# EAGLE design pl8-dip-production (EAGLE 5.06)
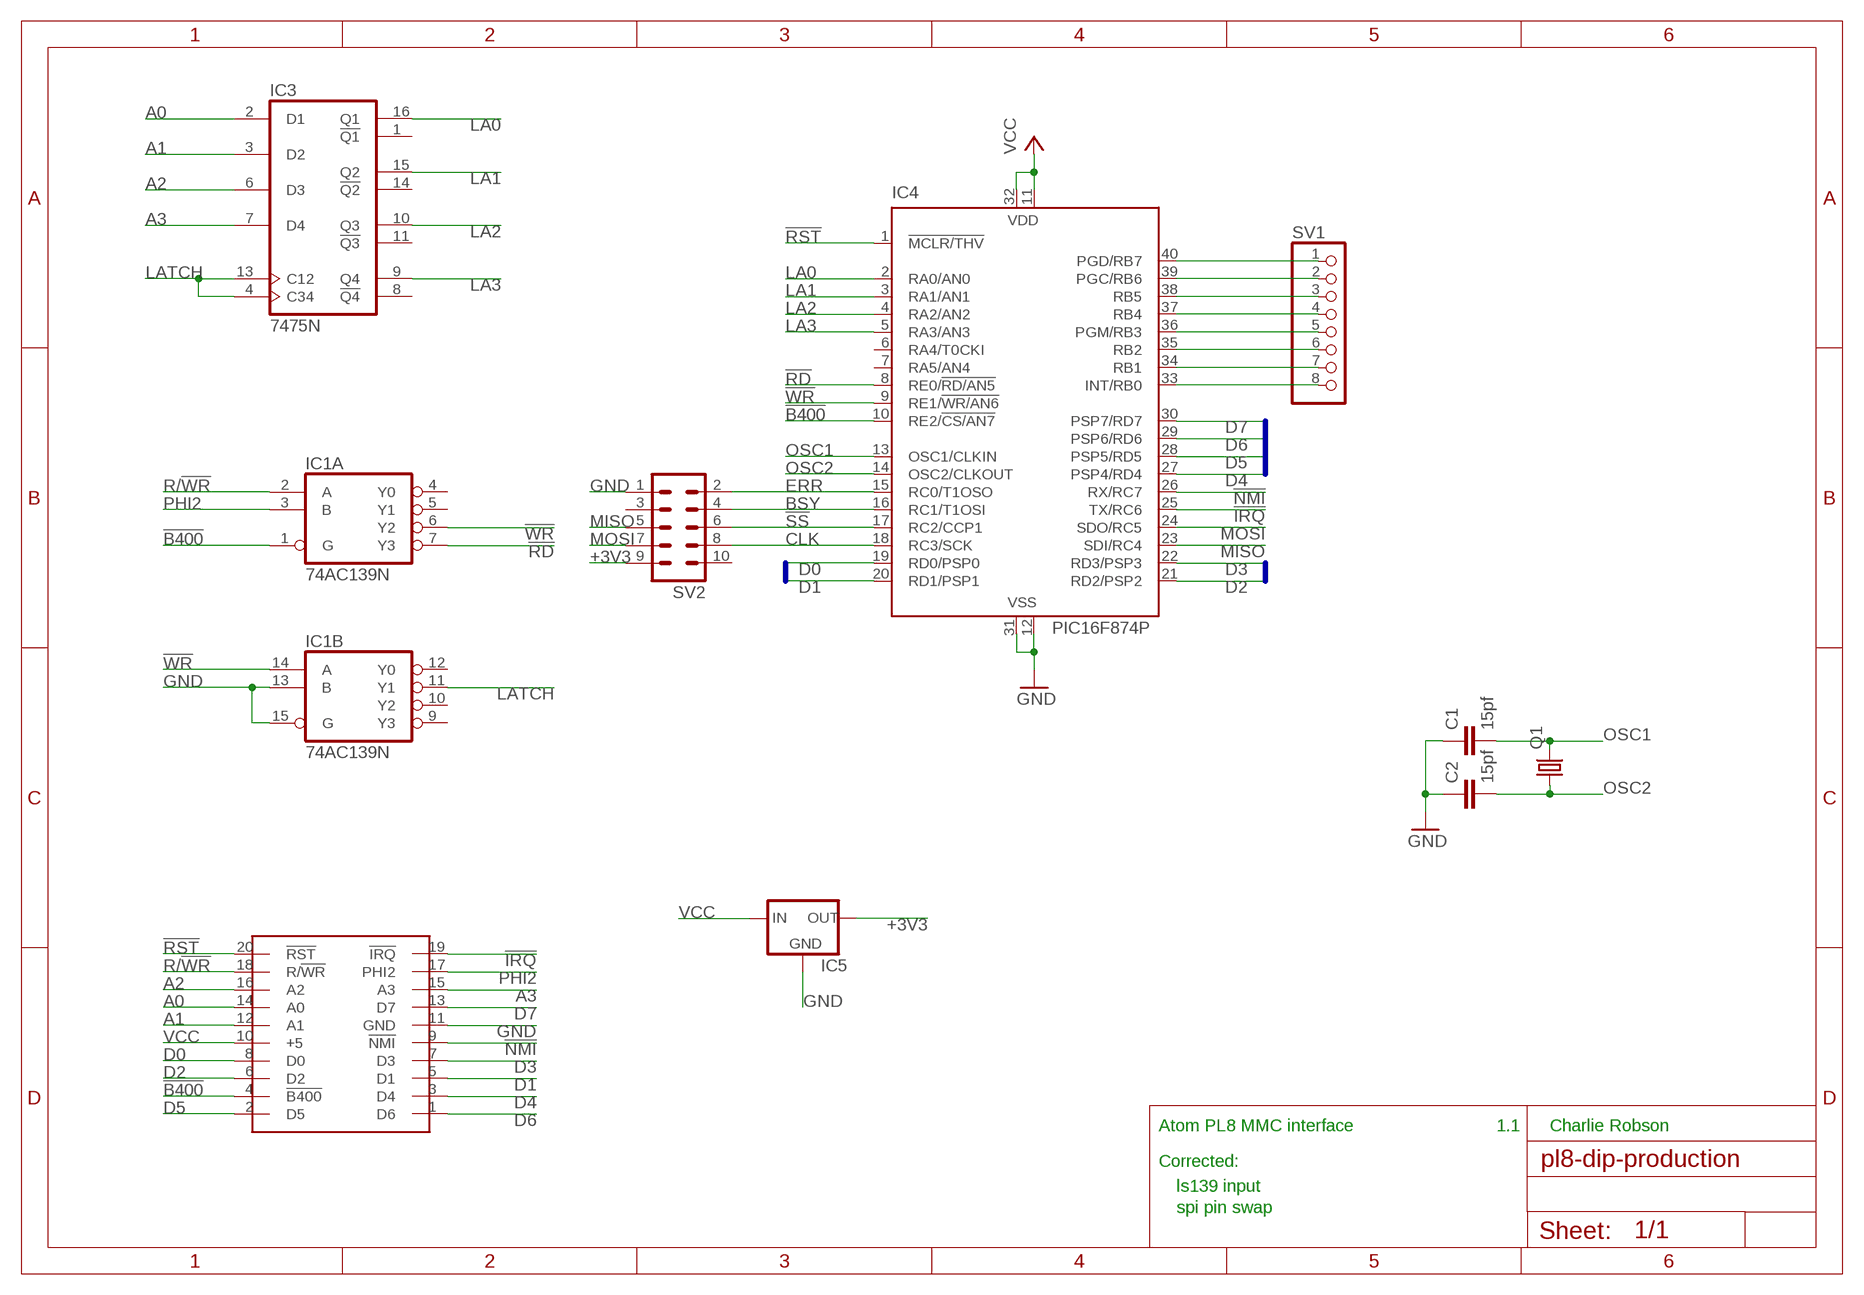
[diagram p0: schematic, sheet 1]

## Parts
C1  15pf  C-EUC1206  [C1206]
C2  15pf  C-EUC1206  [C1206]
IC1  74AC139N  [DIL16]
IC3  7475N  [DIL16]
IC4  PIC16F874P  [DIL40]
IC5  78LXX  [78LXX]
Q1  CRYSTALHC49S  [HC49/S]
SV1  PINHD-1X8  [1X08]
SV2  ML10  [ML10]
U$1  PL8-HEADER-MALE  [HEADER-M]

## Nets
!B400: IC1.1(A:G) IC4.10(RE2/!CS/AN7) U$1.4(!B400)
!IRQ: IC4.25(TX/RC6) U$1.19(!IRQ)
!NMI: IC4.26(RX/RC7) U$1.9(!NMI)
!RD: IC1.7(A:Y3) IC4.8(RE0/!RD/AN5)
!RST: IC4.1(!MCLR/THV) U$1.20(!RST)
!SS: IC4.17(RC2/CCP1) SV2.6
!WR: IC1.6(A:Y2) IC1.14(B:A) IC4.9(RE1/!WR/AN6)
+3V3: IC5.OUT SV2.9
A0: IC3.2(D1) U$1.14(A0)
A1: IC3.3(D2) U$1.12(A1)
A2: IC3.6(D3) U$1.16(A2)
A3: IC3.7(D4) U$1.15(A3)
BSY: IC4.16(RC1/T1OSI) SV2.4
CLK: IC4.18(RC3/SCK) SV2.8
D0: IC4.19(RD0/PSP0) U$1.8(D0)
D1: IC4.20(RD1/PSP1) U$1.5(D1)
D2: IC4.21(RD2/PSP2) U$1.6(D2)
D3: IC4.22(RD3/PSP3) U$1.7(D3)
D4: IC4.27(PSP4/RD4) U$1.3(D4)
D5: IC4.28(PSP5/RD5) U$1.2(D5)
D6: IC4.29(PSP6/RD6) U$1.1(D6)
D7: IC4.30(PSP7/RD7) U$1.13(D7)
ERR: IC4.15(RC0/T1OSO) SV2.2
GND: C1.1 C2.1 IC1.13(B:B) IC1.15(B:G) IC4.12(VSS) IC4.31(VSS) IC5.GND SV2.1 U$1.11(GND)
LA0: IC3.16(Q1) IC4.2(RA0/AN0)
LA1: IC3.15(Q2) IC4.3(RA1/AN1)
LA2: IC3.10(Q3) IC4.4(RA2/AN2)
LA3: IC3.9(Q4) IC4.5(RA3/AN3)
LATCH: IC1.11(B:Y1) IC3.4(C34) IC3.13(C12)
MISO: IC4.23(SDI/RC4) SV2.5
MOSI: IC4.24(SDO/RC5) SV2.7
N$1: IC4.40(PGD/RB7) SV1.1
N$2: IC4.39(PGC/RB6) SV1.2
N$3: IC4.38(RB5) SV1.3
N$4: IC4.37(RB4) SV1.4
N$5: IC4.36(PGM/RB3) SV1.5
N$6: IC4.35(RB2) SV1.6
N$7: IC4.34(RB1) SV1.7
N$8: IC4.33(INT/RB0) SV1.8
OSC1: C1.2 IC4.13(OSC1/CLKIN) Q1.2
OSC2: C2.2 IC4.14(OSC2/CLKOUT) Q1.1
PHI2: IC1.3(A:B) U$1.17(PHI2)
R/!WR: IC1.2(A:A) U$1.18(R/!WR)
VCC: IC4.11(VDD) IC4.32(VDD) IC5.IN U$1.10(+5)
Unconnected: IC1.4(A:Y0) IC1.5(A:Y1) IC1.9(B:Y3) IC1.10(B:Y2) IC1.12(B:Y0) IC3.1(!Q1) IC3.8(!Q4) IC3.11(!Q3) IC3.14(!Q2) IC4.6(RA4/T0CKI) IC4.7(RA5/AN4) SV2.3 SV2.10

## Buses
D[0..7]

## Notes on the sheet
- Atom PL8 MMC interface | 1.1 | Charlie Robson
- Corrected:
- ls139 input
- spi pin swap

## Power pins joined to a net without a drawn wire
GND: IC1.8(P:GND) IC3.12(GND)
VCC: IC1.16(P:VCC) IC3.5(VCC)

## Library data of the parts
C1 C2 = rcl:C-EU: CAPACITOR, European symbol
IC1 = 74xx-eu:74*139: Dual 2-line to 4-line DECODER/DEMULTIPLEXER
IC3 = 74xx-eu:74*75: 4-bit bistable LATCH
IC4 = microchip:PIC16F87*: MICROCONTROLLER
IC5 = v-reg:78LXX: VOLTAGE REGULATOR
Q1 = crystal:CRYSTAL: CRYSTAL
SV1 = pinhead:PINHD-1X8: PIN HEADER
SV2 = con-harting-ml:ML10: HARTING
U$1 = atom:PL8-HEADER-MALE

## Board
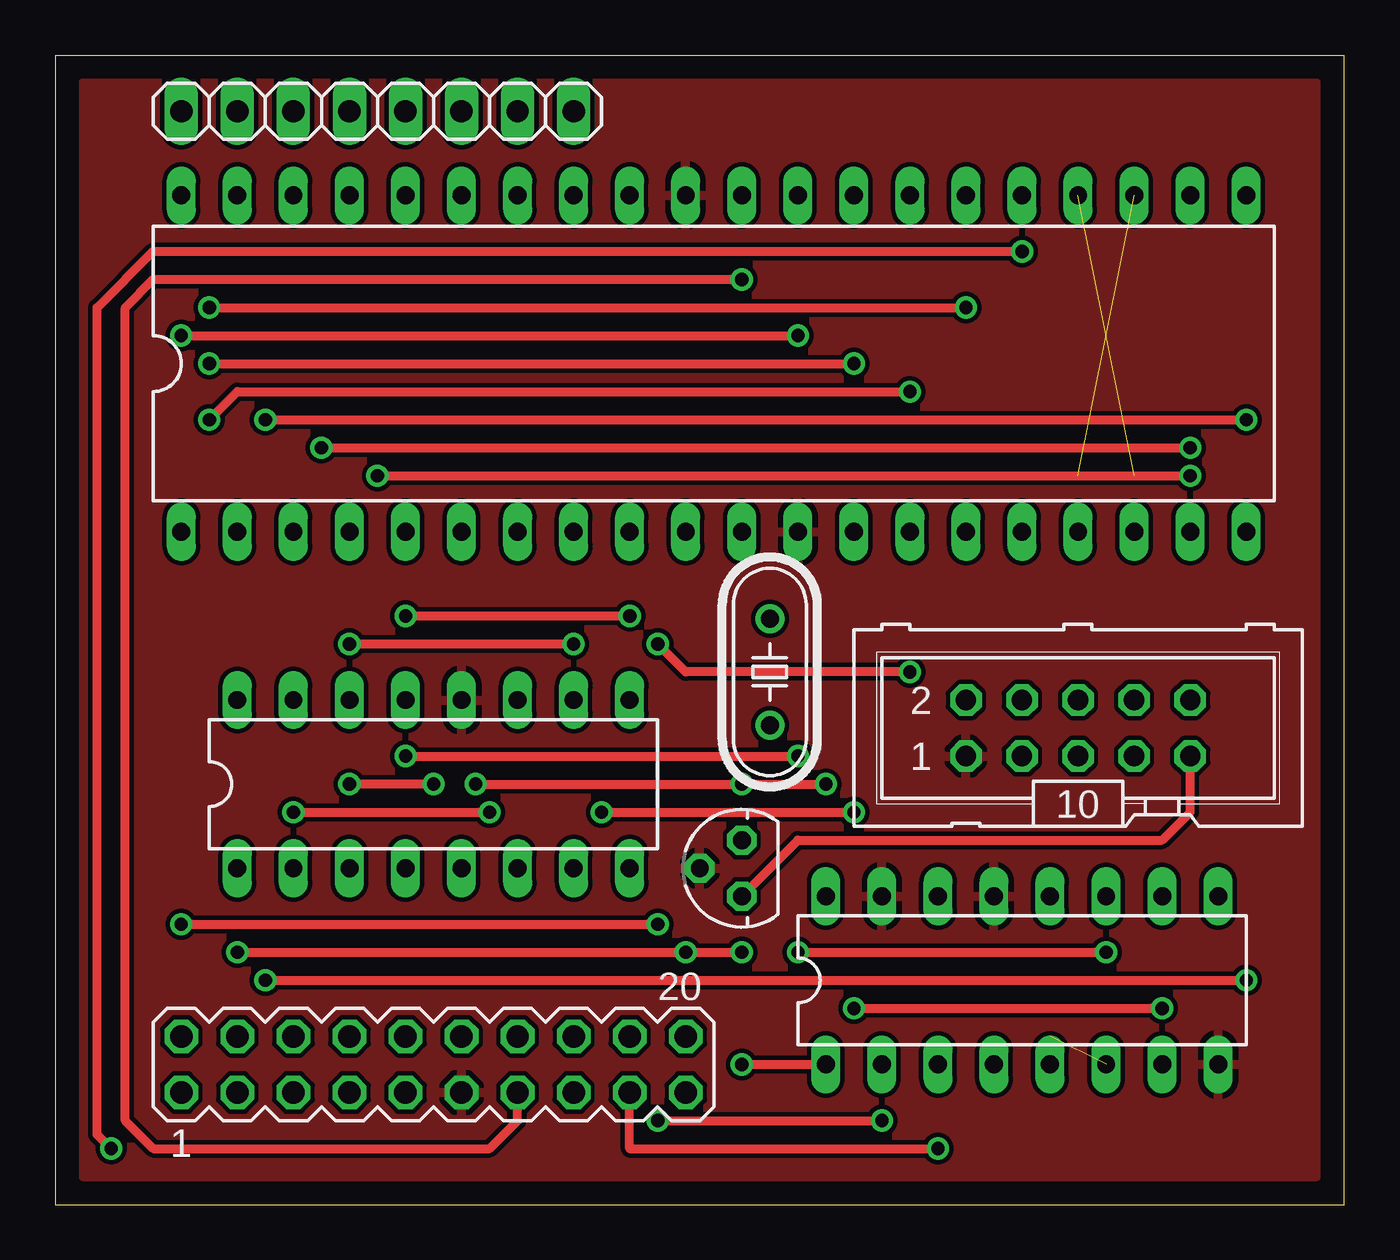
[diagram p1: board, top side]
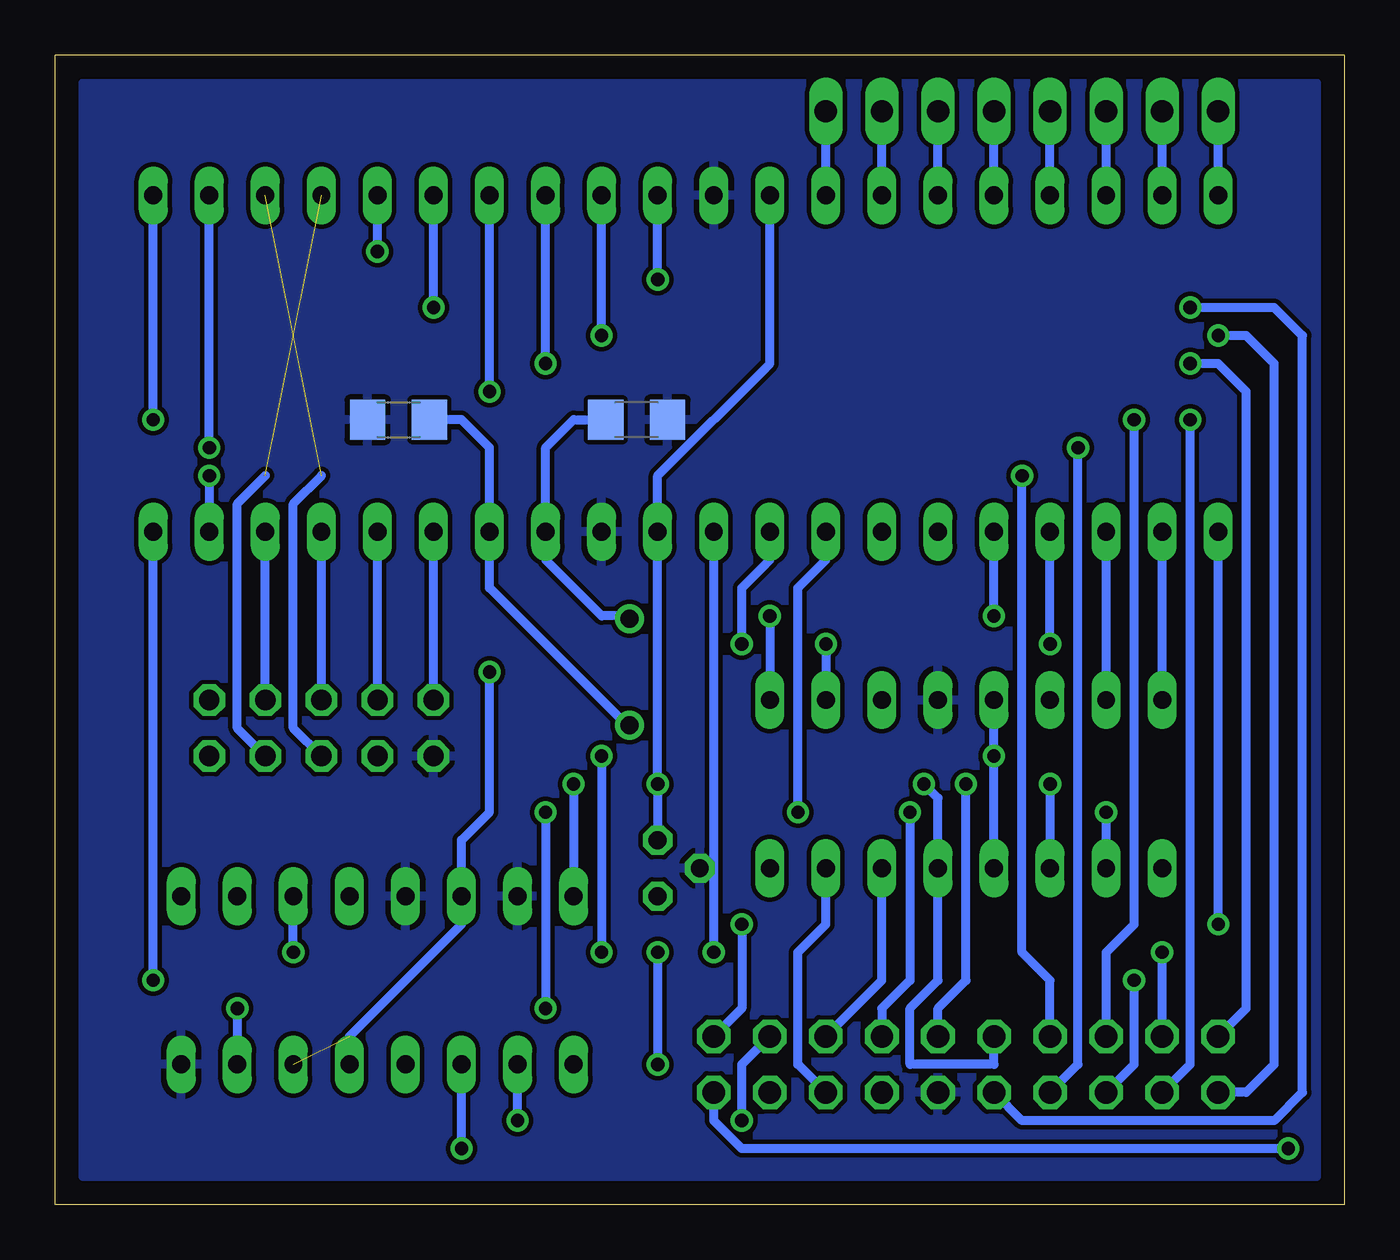
[diagram p2: board, bottom side, seen from below]

Size 58.42 x 52.07 mm. Coordinates in mm from the lower left corner, seen from the top.
Outline: 58.41,52.06 58.41,0 0,0 0,52.06
Outline: 0,52.07 58.42,52.07
Copper layers (1*16): Top 0.035mm / dielectric 1.5mm / Bottom 0.035mm
Design rules "default": minimum track width 10mil, minimum drill 24mil, track to track 8mil, track to pad 8mil, pad to pad 8mil, via to via 8mil, smd to smd 8mil, copper to edge 40mil, drill to drill 8mil, minimum pad ring 10mil, minimum via ring 8mil, stop-mask expansion 4mil, vias tented up to drill 0mil, thermal gap 10mil

### Footprints (pad centres in the part's own frame; a part is rotated, then mirrored left to right if it is on the bottom)
C1206 = smd 1.6 x 1.8: 1 -1.4,0; 2 1.4,0
DIL16 = drill 0.813 long: 1 -8.89,-3.81; 2 -6.35,-3.81; 3 -3.81,-3.81; 4 -1.27,-3.81; 5 1.27,-3.81; 6 3.81,-3.81; 7 6.35,-3.81; 8 8.89,-3.81; 9 8.89,3.81; 10 6.35,3.81; 11 3.81,3.81; 12 1.27,3.81; 13 -1.27,3.81; 14 -3.81,3.81; 15 -6.35,3.81; 16 -8.89,3.81
DIL40 = drill 0.813 long: 1 -24.13,-7.62; 2 -21.59,-7.62; 3 -19.05,-7.62; 4 -16.51,-7.62; 5 -13.97,-7.62; 6 -11.43,-7.62; 7 -8.89,-7.62; 8 -6.35,-7.62; 9 -3.81,-7.62; 10 -1.27,-7.62; 11 1.27,-7.62; 12 3.81,-7.62; 13 6.35,-7.62; 14 8.89,-7.62; 15 11.43,-7.62; 16 13.97,-7.62; 17 16.51,-7.62; 18 19.05,-7.62; 19 21.59,-7.62; 20 24.13,-7.62; 21 24.13,7.62; 22 21.59,7.62; 23 19.05,7.62; 24 16.51,7.62; 25 13.97,7.62; 26 11.43,7.62; 27 8.89,7.62; 28 6.35,7.62; 29 3.81,7.62; 30 1.27,7.62; 31 -1.27,7.62; 32 -3.81,7.62; 33 -6.35,7.62; 34 -8.89,7.62; 35 -11.43,7.62; 36 -13.97,7.62; 37 -16.51,7.62; 38 -19.05,7.62; 39 -21.59,7.62; 40 -24.13,7.62
78LXX = drill 0.813 octagon: GND 0,1.905; IN 1.27,0; OUT -1.27,0
HC49/S = drill 0.813 round: 1 -2.413,0; 2 2.413,0
1X08 = drill 1.016 long: 1 -8.89,0; 2 -6.35,0; 3 -3.81,0; 4 -1.27,0; 5 1.27,0; 6 3.81,0; 7 6.35,0; 8 8.89,0
ML10 = drill 0.914 octagon: 1 -5.08,-1.27; 2 -5.08,1.27; 3 -2.54,-1.27; 4 -2.54,1.27; 5 0,-1.27; 6 0,1.27; 7 2.54,-1.27; 8 2.54,1.27; 9 5.08,-1.27; 10 5.08,1.27
HEADER-M = drill 1.016 octagon: 1 -11.43,-1.27; 2 -11.43,1.27; 3 -8.89,-1.27; 4 -8.89,1.27; 5 -6.35,-1.27; 6 -6.35,1.27; 7 -3.81,-1.27; 8 -3.81,1.27; 9 -1.27,-1.27; 10 -1.27,1.27; 11 1.27,-1.27; 12 1.27,1.27; 13 3.81,-1.27; 14 3.81,1.27; 15 6.35,-1.27; 16 6.35,1.27; 17 8.89,-1.27; 18 8.89,1.27; 19 11.43,-1.27; 20 11.43,1.27

### Placement (x,y rotation side)
C1  32.07,35.56 180 bottom
C2  42.86,35.56 0 bottom
IC1  43.81,10.16 0 top
IC3  17.14,19.05 0 top
IC4  29.84,38.1 0 top
IC5  31.11,15.24 90 top
Q1  32.38,24.13 90 top
SV1  14.61,49.53 0 top
SV2  46.35,21.59 0 top
U$1  17.14,6.35 0 top

### Tracks (layer width: path | path; a pad name or v marks a point on that pad's centre or on a via)
!B400  (via drill 0.6)
  Top 0.406: v8.26,11.43 v28.57,11.43 v31.11,11.43 | v31.11,6.35 IC1.1
  Bottom 0.406: U$1.4 v8.26,11.43 | v28.57,11.43 IC4.10 | v31.11,11.43 v31.11,6.35
!IRQ  (via drill 0.6)
  Top 0.406: v43.81,43.18 4.45,43.18 1.91,40.64 1.91,3.17 v2.54,2.54
  Bottom 0.406: v43.81,43.18 IC4.25 | v2.54,2.54 27.3,2.54 28.57,3.81 U$1.19
!NMI  (via drill 0.6)
  Top 0.406: v6.99,40.64 v41.27,40.64
  Bottom 0.406: U$1.9 14.61,3.81 3.17,3.81 1.91,5.08 1.91,39.37 3.17,40.64 v6.99,40.64 | v41.27,40.64 IC4.26
!RD  (via drill 0.6)
  Top 0.406: v24.77,17.78 v36.2,17.78 | v36.2,8.89 v50.16,8.89
  Bottom 0.406: IC4.8 23.5,29.21 24.77,27.94 v24.77,17.78 | v36.2,17.78 v36.2,8.89 | v50.16,8.89 IC1.7
!RST  (via drill 0.6)
  Top 0.406: v5.71,12.7 v27.3,12.7
  Bottom 0.406: U$1.20 27.3,8.89 v27.3,12.7 | v5.71,12.7 IC4.1
!SS
  Bottom 0.406: SV2.6 IC4.17
!WR  (via drill 0.6)  (1 unrouted)
  Top 0.406: v27.3,25.4 28.57,24.13 v38.73,24.13
  Bottom 0.406: IC4.9 26.04,29.21 27.3,27.94 v27.3,25.4 | v38.73,24.13 38.73,17.78 40.01,16.51 IC1.14 40.01,12.7 45.09,7.62
+3V3
  Top 0.406: IC5.OUT 33.66,16.51 50.16,16.51 51.44,17.78 SV2.9
A0  (via drill 0.6)
  Top 0.406: v10.79,17.78 v19.68,17.78
  Bottom 0.406: IC3.2 v10.79,17.78 | v19.68,17.78 19.68,10.16 20.95,8.89 U$1.14
A1  (via drill 0.6)
  Top 0.406: v17.14,19.05 v13.34,19.05
  Bottom 0.406: v13.34,19.05 IC3.3 | v17.14,19.05 17.14,10.16 18.41,8.89 U$1.12
A2
  Bottom 0.406: IC3.6 20.95,10.16 U$1.16
A3
  Bottom 0.406: U$1.15 24.77,6.35 24.77,11.43 23.5,12.7 IC3.7
BSY
  Bottom 0.406: SV2.4 IC4.16
CLK
  Bottom 0.406: SV2.8 IC4.18
D0  (via drill 0.6)
  Top 0.406: v14.61,33.02 v51.44,33.02
  Bottom 0.406: U$1.8 13.34,10.16 14.61,11.43 v14.61,33.02 | v51.44,33.02 IC4.19
D1  (via drill 0.6)
  Top 0.406: v9.53,10.16 v53.98,10.16
  Bottom 0.406: U$1.5 9.53,6.35 v9.53,10.16 | v53.98,10.16 IC4.20
D2  (via drill 0.6)
  Top 0.406: v9.53,35.56 v53.98,35.56
  Bottom 0.406: U$1.6 10.79,11.43 9.53,12.7 v9.53,35.56 | v53.98,35.56 IC4.21
D3  (via drill 0.6)
  Top 0.406: v12.06,34.29 v51.44,34.29
  Bottom 0.406: U$1.7 12.06,6.35 v12.06,34.29 | v51.44,34.29 IC4.22
D4  (via drill 0.6)
  Top 0.406: v6.99,35.56 8.26,36.83 v38.73,36.83
  Bottom 0.406: U$1.3 6.99,6.35 v6.99,35.56 | v38.73,36.83 IC4.27
D5  (via drill 0.6)
  Top 0.406: v6.99,38.1 v36.2,38.1
  Bottom 0.406: U$1.2 4.45,8.89 4.45,36.83 5.71,38.1 v6.99,38.1 | v36.2,38.1 IC4.28
D6  (via drill 0.6)
  Top 0.406: v5.71,39.37 v33.66,39.37
  Bottom 0.406: U$1.1 4.45,5.08 3.17,6.35 3.17,38.1 4.45,39.37 v5.71,39.37 | v33.66,39.37 IC4.29
D7  (via drill 0.6)
  Top 0.406: U$1.13 20.95,3.81 19.68,2.54 4.45,2.54 3.17,3.81 3.17,40.64 4.45,41.91 v31.11,41.91
  Bottom 0.406: v31.11,41.91 IC4.30
ERR
  Bottom 0.406: SV2.2 IC4.15
GND
  pour Top: 1.27,50.8 1.27,1.27 57.15,1.27 57.15,50.8
  pour Bottom: 1.27,50.8 1.27,1.27 57.15,1.27 57.15,50.8
LA0
  Bottom 0.406: IC3.16 IC4.2
LA1
  Bottom 0.406: IC3.15 IC4.3
LA2  (via drill 0.6)
  Top 0.406: v13.34,25.4 v23.5,25.4
  Bottom 0.406: v13.34,25.4 IC4.4 | v23.5,25.4 IC3.10
LA3  (via drill 0.6)
  Top 0.406: v15.88,26.67 v26.04,26.67
  Bottom 0.406: v15.88,26.67 IC4.5 | v26.04,26.67 IC3.9
LATCH  (via drill 0.6)
  Top 0.406: v15.88,20.32 v33.66,20.32 | v33.66,11.43 v47.62,11.43
  Bottom 0.406: IC3.13 v15.88,20.32 IC3.4 | v33.66,20.32 v33.66,11.43 | v47.62,11.43 IC1.11
MISO  (1 unrouted)
  Bottom 0.406: 46.35,33.02 47.62,31.75 47.62,21.59 SV2.5
MOSI  (1 unrouted)
  Bottom 0.406: 48.9,33.02 50.16,31.75 50.16,21.59 SV2.7
N$1
  Bottom 0.406: IC4.40 SV1.1
N$2
  Bottom 0.406: IC4.39 SV1.2
N$3
  Bottom 0.406: IC4.38 SV1.3
N$4
  Bottom 0.406: IC4.37 SV1.4
N$5
  Bottom 0.406: IC4.36 SV1.5
N$6
  Bottom 0.406: IC4.35 SV1.6
N$7
  Bottom 0.406: IC4.34 SV1.7
N$8
  Bottom 0.406: IC4.33 SV1.8
OSC1
  Bottom 0.406: C1.2 34.92,35.56 36.2,34.29 IC4.13 36.2,29.21 33.66,26.67 32.51,26.67 Q1.2
OSC2
  Bottom 0.406: C2.2 40.01,35.56 38.73,34.29 IC4.14 38.73,27.94 32.51,21.72 Q1.1
PHI2  (via drill 0.6)
  Top 0.406: U$1.17 26.04,2.54 v40.01,2.54
  Bottom 0.406: v40.01,2.54 IC1.3
R/!WR  (via drill 0.6)
  Top 0.406: v27.3,3.81 v37.47,3.81
  Bottom 0.406: U$1.18 27.3,6.35 v27.3,3.81 | v37.47,3.81 IC1.2
VCC  (via drill 0.6)
  Top 0.406: v19.05,19.05 v31.11,19.05 v34.92,19.05
  Bottom 0.406: IC4.32 26.04,38.1 31.11,33.02 IC4.11 v31.11,19.05 IC5.IN | U$1.10 15.88,6.35 19.68,6.35 19.68,8.89 18.41,10.16 IC3.5 18.41,18.41 v19.05,19.05 | v34.92,19.05 IC1.16